# EAGLE design ModularLight (EAGLE 6.1)
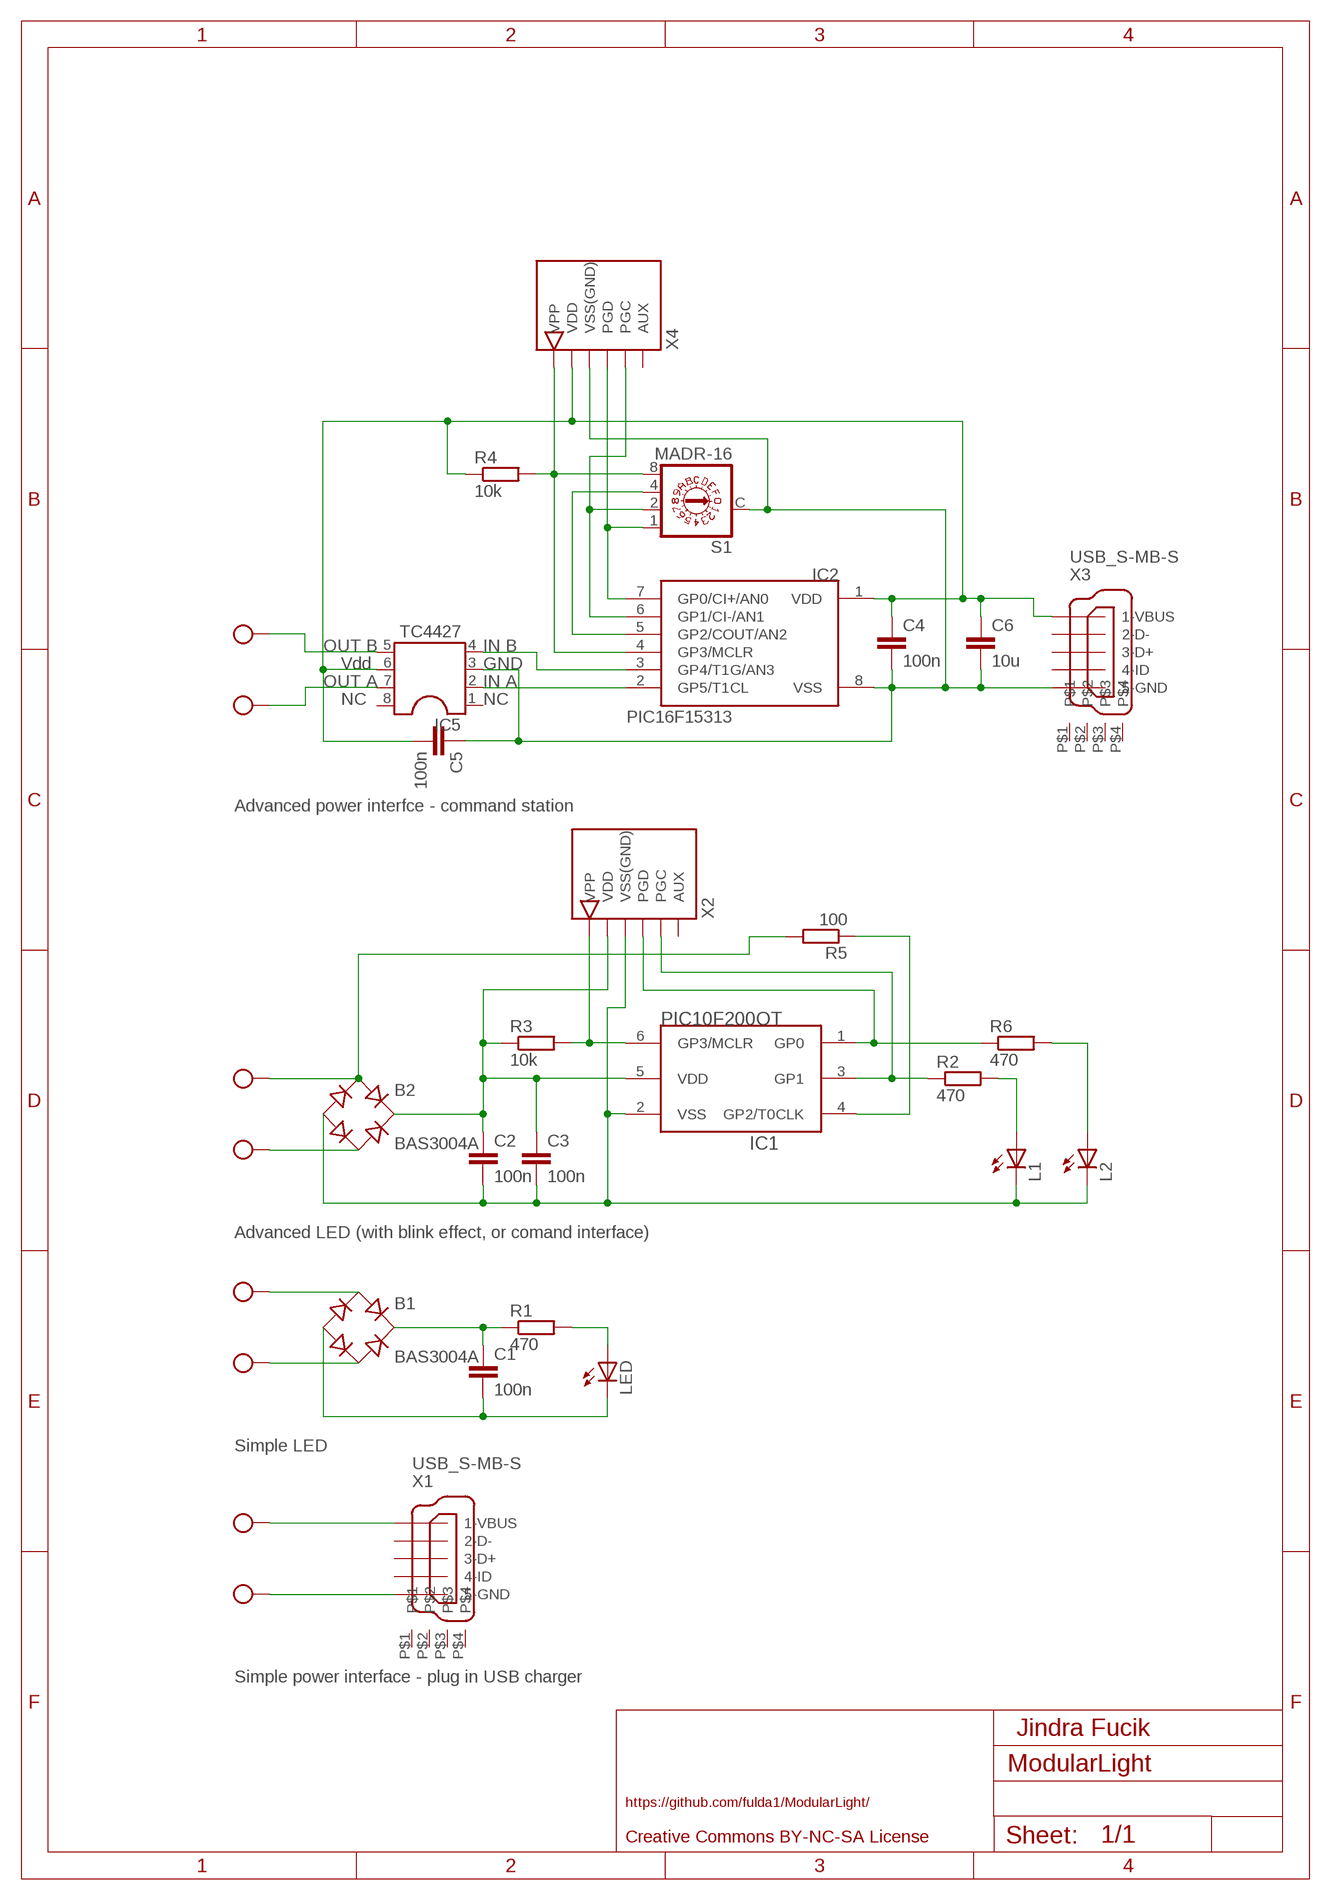
[diagram p0: schematic, sheet 1]

## Parts
B1  BAS3004A  RECTIFIER-SOT143  [SOT143]
B2  BAS3004A  RECTIFIER-SOT143  [SOT143]
C1  100n  C-EUC0805  [C0805]
C2  100n  C-EUC0805  [C0805]
C3  100n  C-EUC0805  [C0805]
C4  100n  C-EUC0805  [C0805]
C5  100n  C-EUC0805  [C0805]
C6  10u  C-EUC0805  [C0805]
IC1  PIC10F200OT  [SOT23-6]
IC2  PIC16F15313  PIC12F629SN  [SO-08]
IC5  TC4427  SO-08  [SO-08]
J1  PINHEAD_B  [2PIN_L]
J2  PINHEAD_B  [2PIN_L]
J3  PINHEAD_B  [2PIN_L]
J4  PINHEAD_B  [2PIN_L]
L1  LED3MM_I  [LED3MM_I]
L2  LED3MM_I  [LED3MM_I]
LED  LED3MM_I  [LED3MM_I]
R1  470  R-EU_R0805  [R0805]
R2  470  R-EU_R0805  [R0805]
R3  10k  R-EU_R0805  [R0805]
R4  10k  R-EU_R0805  [R0805]
R5  100  R-EU_R0805  [R0805]
R6  470  R-EU_R0805  [R0805]
S1  MADR-16  P103  [P103]
X1  USB_S-MB-S  [USB-MB-S]
X2  PICKITXS  [6PIN3]
X3  USB_S-MB-S  [USB-MB-S]
X4  PICKITXS  [6PIN3]

## Nets
N$1: J1.1 X1.VBUS(1-VBUS)
N$2: J1.2 X1.GND(5-GND)
N$3: B1.2(AC1) J2.1
N$4: B1.3(AC2) J2.2
N$5: B1.1(-) C1.2 LED.K(C)
N$6: B1.4(+) C1.1 R1.1
N$7: LED.A R1.2
N$8: B2.2(AC1) J3.1 R5.2
N$9: B2.3(AC2) J3.2
N$10: B2.1(-) C2.2 C3.2 IC1.2(VSS) L1.K(C) L2.K(C) X2.P$3(VSS(GND))
N$11: IC5.7 J4.2
N$12: L1.A R2.2
N$13: IC1.4(GP2/T0CLK) R5.1
N$14: IC1.6(GP3/MCLR) R3.2 X2.P$1(VPP)
N$15: B2.4(+) C2.1 C3.1 IC1.5(VDD) R3.1 X2.P$2(VDD)
N$16: IC1.3(GP1) R2.1 X2.P$5(PGC)
N$17: IC1.1(GP0) R6.1 X2.P$4(PGD)
N$18: IC5.5 J4.1
N$19: C4.2 C5.1 C6.2 IC2.8(VSS) IC5.3 S1.C X3.GND(5-GND) X4.P$3(VSS(GND))
N$20: C4.1 C5.2 C6.1 IC2.1(VDD) IC5.6 R4.1 X3.VBUS(1-VBUS) X4.P$2(VDD)
N$21: L2.A R6.2
N$22: IC2.2(GP5/T1CL) IC5.2
N$23: IC2.3(GP4/T1G/AN3) IC5.4
N$24: IC2.7(GP0/CI+/AN0) S1.1 X4.P$4(PGD)
N$25: IC2.6(GP1/CI-/AN1) S1.2 X4.P$5(PGC)
N$26: IC2.5(GP2/COUT/AN2) S1.4
N$27: IC2.4(GP3/MCLR) R4.2 S1.8 X4.P$1(VPP)
Unconnected: IC5.1 IC5.8 X1.D+(3-D+) X1.D-(2-D-) X1.ID(4-ID) X1.P$1 X1.P$2 X1.P$3 X1.P$4 X2.P$6(AUX) X3.D+(3-D+) X3.D-(2-D-) X3.ID(4-ID) X3.P$1 X3.P$2 X3.P$3 X3.P$4 X4.P$6(AUX)

## Notes on the sheet
- OUT B | IN B
- Vdd | GND
- OUT A | IN A
- NC | NC
- Advanced power interfce - command station
- Advanced LED (with blink effect, or comand interface)
- Simple LED
- Simple power interface - plug in USB charger
- Jindra Fucik
- https://github.com/fulda1/ModularLight/
- Creative Commons BY-NC-SA License

## Library data of the parts
B1 B2 = rectifier:RECTIFIER-: Rectifier
C1-C6 = rcl:C-EU: CAPACITOR, European symbol
IC1 = microchip-5:PIC10F20*: uPC nW 0,25/0,5k Program Flash memory
IC2 = microchip-5:PIC12F6*: uPC nW 1k Program Flash memory 2x Timer Comparator 10b A/D converter/ 4xIN
IC5 = ic-package:SO-08: Small Outline / Socket
J1-J4 = jfu_drivers:PINHEAD_B
L1 L2 LED = led:LED: LED OSRAM: - CHIPLED LG R971, LG N971, LY N971, LG Q971, LY Q971, LO R971, LY R971 LH N974, LH R974 LS Q976, LO Q976, LY Q976 LO Q996 - Hyper CHIPLED LW Q18S LB Q993, LB Q99A, LB R99A - SideLED LS A670, LO A670, LY A670, LG A670, LP A670 LB A673, LV A673, LT A673, LW A673 LH A674 LY A675 LS A676, LA A676, LO A676, LY A676, LW A676 LS A679, LY A679, LG A679 - Hyper Micro SIDELED® LS Y876, LA Y876, LO Y876, LY Y876 LT Y87S - SmartLED LW L88C, LW L88S LB L89C, LB L89S, LG L890 LS L89K, LO L89K, LY L89K LS L896, LA L896, LO L896, LY L896 - TOPLED LS T670, LO T670, LY T670, LG T670, LP T670 LSG T670, LSP T670, LSY T670, LOP T670, LYG T670 LG T671, LOG T671, LSG T671 LB T673, LV T673, LT T673, LW T673 LH T674 LS T676, LA T676, LO T676, LY T676, LB T676, LH T676, LSB T676, LW T676 LB T67C, LV T67C, LT T67C, LS T67K, LO T67K, LY T67K, LW E67C LS E67B, LA E67B, LO E67B, LY E67B, LB E67C, LV E67C, LT E67C LW T67C LS T679, LY T679, LG T679 LS T770, LO T770, LY T770, LG T770, LP T770 LB T773, LV T773, LT T773, LW T773 LH T774 LS E675, LA E675, LY E675, LS T675 LS T776, LA T776, LO T776, LY T776, LB T776 LHGB T686 LT T68C, LB T68C - Hyper Mini TOPLED® LB M676 - Mini TOPLED Santana® LG M470 LS M47K, LO M47K, LY M47K Source: http://www.osram.convergy.de LUXEON: - LUMILED® LXK2-PW12-R00, LXK2-PW12-S00, LXK2-PW14-U00, LXK2-PW14-V00 LXK2-PM12-R00, LXK2-PM12-S00, LXK2-PM14-U00 LXK2-PE12-Q00, LXK2-PE12-R00, LXK2-PE12-S00, LXK2-PE14-T00, LXK2-PE14-U00 LXK2-PB12-K00, LXK2-PB12-L00, LXK2-PB12-M00, LXK2-PB14-N00, LXK2-PB14-P00, LXK2-PB14-Q00 LXK2-PR12-L00, LXK2-PR12-M00, LXK2-PR14-Q00, LXK2-PR14-R00 LXK2-PD12-Q00, LXK2-PD12-R00, LXK2-PD12-S00 LXK2-PH12-R00, LXK2-PH12-S00 LXK2-PL12-P00, LXK2-PL12-Q00, LXK2-PL12-R00 Source: www.luxeon.com KINGBRIGHT: KA-3528ASYC Source: www.kingbright.com
R1-R6 = rcl:R-EU_: RESISTOR, European symbol
S1 = switch-dil:P103: DIL/CODE SWITCH; OC_FARNELL: unknown; OC_NEWARK: unknown
X1 X3 = con-usb-3:USB_S: USB Connectors with shield
X2 X4 = jfu_drivers:PICKIT

## Board
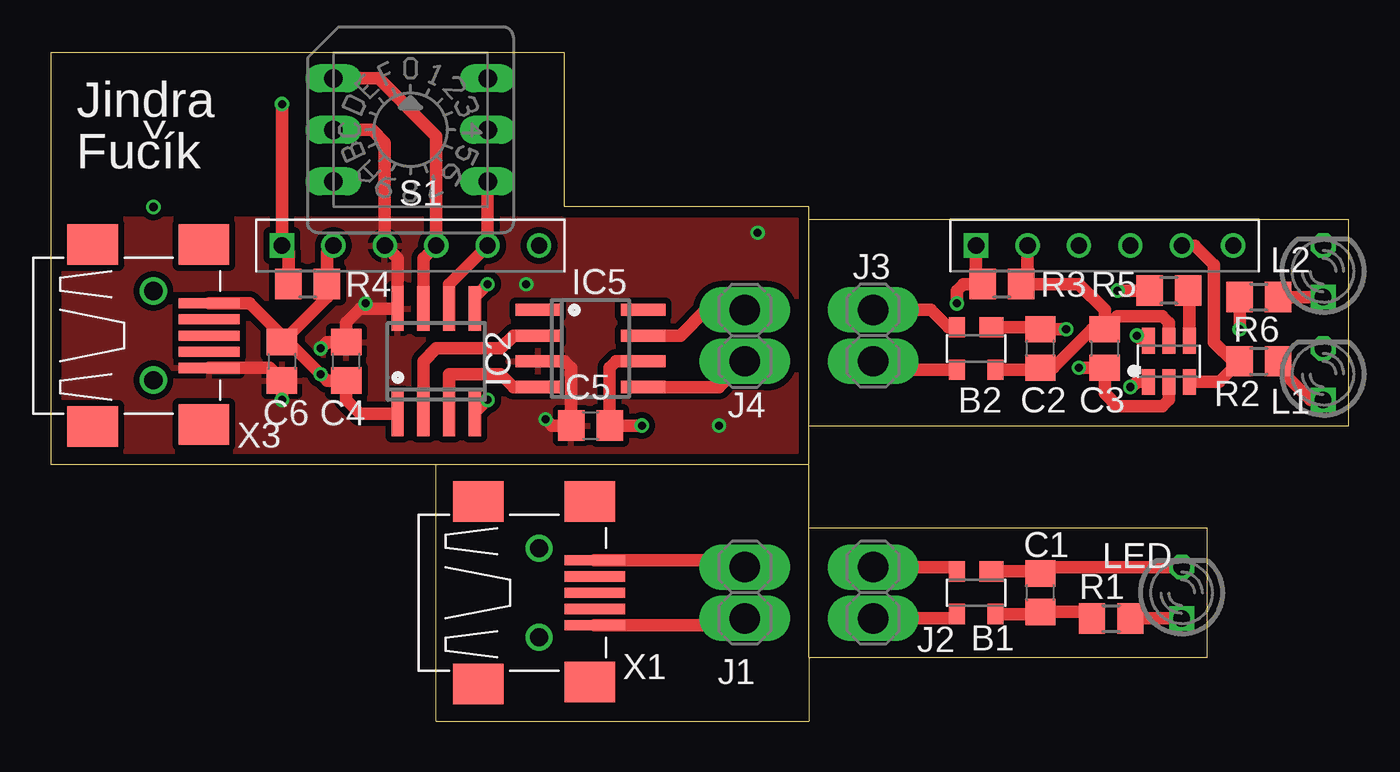
[diagram p1: board, top side]
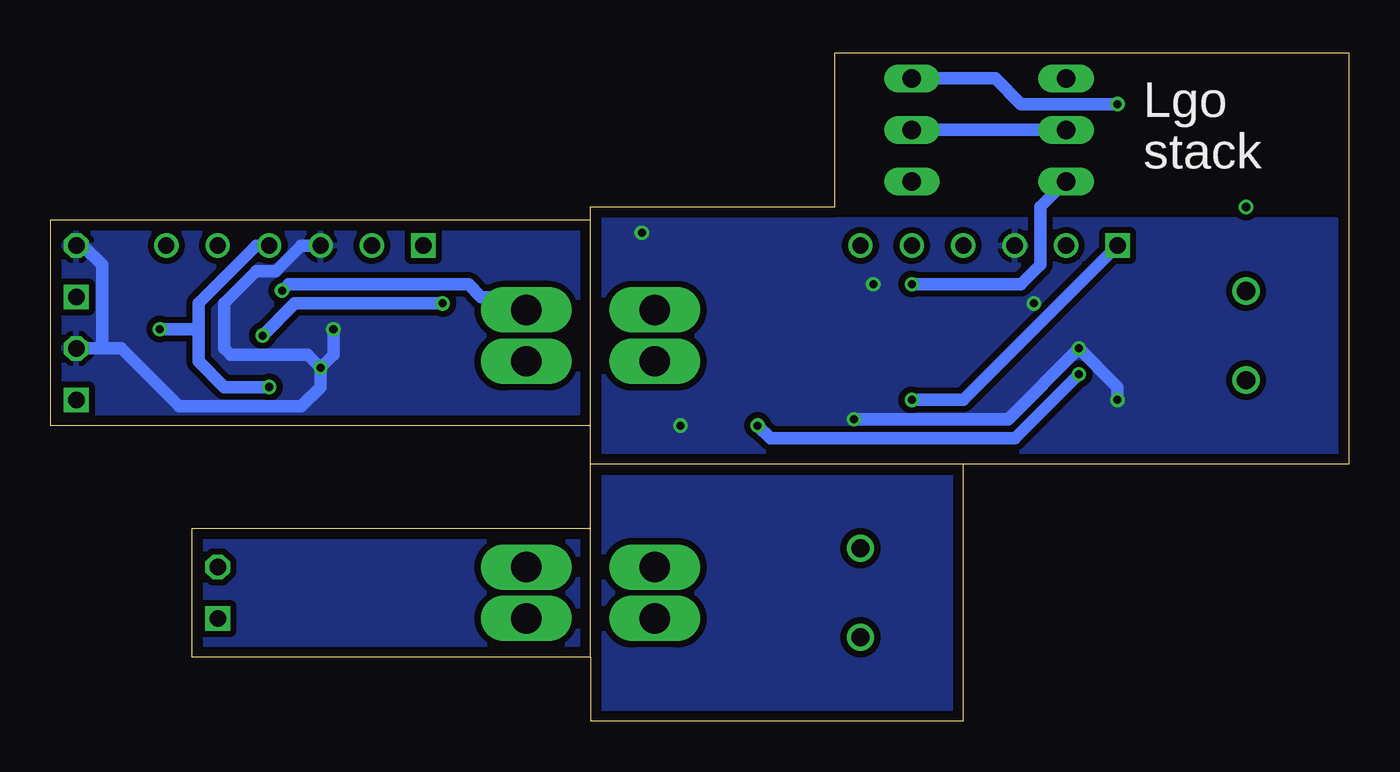
[diagram p2: board, bottom side, seen from below]

Size 64.14 x 33.02 mm. Coordinates in mm from the lower left corner, seen from the top.
Outline: 19.05,12.7 0,12.7 0,33.02 25.4,33.02 25.4,25.4 37.47,25.4 37.47,24.77
Outline: 37.47,3.17 57.15,3.17 57.15,9.53 37.47,9.53
Outline: 37.47,9.53 37.47,12.7
Outline: 37.47,12.7 37.47,14.61
Outline: 37.47,3.17 37.47,0 19.05,0 19.05,12.7
Outline: 37.47,14.61 64.14,14.61 64.14,24.77 37.47,24.77
Outline: 19.05,12.7 37.47,12.7
Outline: 37.47,14.61 37.47,24.77
Outline: 37.47,3.17 37.47,9.53
Copper layers (1*16): Top 0.035mm / dielectric 1.6mm / Bottom 0.035mm
Design rules: minimum track width 6mil, minimum drill 12mil, track to track 6mil, track to pad 6mil, pad to pad 6mil, via to via 8mil, smd to smd 0mil, copper to edge 20mil, drill to drill 10mil, minimum pad ring 6mil, minimum via ring 6mil, stop-mask expansion 0mil, vias tented up to drill 100mil, thermal gap 10mil

### Footprints (pad centres in the part's own frame; a part is rotated, then mirrored left to right if it is on the bottom)
SOT143 = smd 1.2 x 1: 1 -0.75,-1.05 | smd 0.8 x 1: 2 0.95,-1.05; 3 0.95,1.05; 4 -0.95,1.05
C0805 = smd 1.3 x 1.5: 1 -0.95,0; 2 0.95,0
SOT23-6 = smd 0.635 x 1.27: 1 -1.016,-1.016; 2 0,-1.016; 3 1.016,-1.016; 4 1.016,1.016; 5 0,1.016; 6 -1.016,1.016
SO-08 = smd 0.6 x 2.2: 1 -1.905,-2.6; 2 -0.635,-2.6; 3 0.635,-2.6; 4 1.905,-2.6; 5 1.905,2.6; 6 0.635,2.6; 7 -0.635,2.6; 8 -1.905,2.6
2PIN_L = drill 1.5 long: 1 -1.27,0; 2 1.27,0
LED3MM_I = drill 0.813 square: A -1.27,0 | drill 0.813 octagon: K 1.27,0
R0805 = smd 1.3 x 1.5: 1 -0.95,0; 2 0.95,0
P103 = drill 0.914 long: 1 3.81,-2.54; 2 -3.81,2.54; 4 3.81,2.54; 8 -3.81,-2.54; C 3.81,0; C1 -3.81,0
USB-MB-S = smd 3 x 0.5: D+ 2.75,0; D- 2.75,0.8; GND 2.75,-1.6; ID 2.75,-0.8; VBUS 2.75,1.6 | smd 2.5 x 2: P$1 -3,-4.5; P$2 -3,4.5; P$3 2.5,-4.4; P$4 2.5,4.5 | drill 0.9 pad 1.016: P$5 0,2.2; P$6 0,-2.2
6PIN3 = drill 0.8 square: P$1 0,6.35 | drill 0.8: P$2 0,3.81; P$3 0,1.27; P$4 0,-1.27; P$5 0,-3.81; P$6 0,-6.35

### Placement (x,y rotation side)
B1  45.72,6.35 180 top
B2  45.72,18.41 180 top
C1  48.9,6.35 90 top
C2  48.9,18.41 90 top
C3  52.07,18.41 270 top
C4  14.61,17.78 90 top
C5  26.67,14.61 0 top
C6  11.43,17.78 270 top
IC1  55.24,17.78 0 top
IC2  19.05,17.78 0 top
IC5  26.67,18.41 270 top
J1  34.29,6.35 270 top
J2  40.64,6.35 270 top
J3  40.64,19.05 270 top
J4  34.29,19.05 90 top
L1  62.87,17.14 90 top
L2  62.87,22.23 90 top
LED  55.88,6.35 90 top
R1  52.39,5.08 0 top
R2  59.69,17.78 0 top
R3  46.99,21.59 180 top
R4  12.7,21.59 180 top
R5  55.24,21.27 180 top
R6  59.69,20.95 0 top
S1  17.78,29.21 180 top
X1  24.13,6.35 0 top
X2  52.07,23.5 90 top
X3  5.08,19.05 0 top
X4  17.78,23.5 90 top

### Tracks (layer width: path | path; a pad name or v marks a point on that pad's centre or on a via)
N$1
  Top 0.61: X1.VBUS 33.96,7.95 J1.1
N$2
  Top 0.61: X1.GND 33.96,4.75 J1.2
N$3
  Top 0.61: J2.1 44.55,7.62 B1.2
N$4
  Top 0.61: J2.2 44.55,5.08 B1.3
N$5
  Top 0.61: B1.1 48.8,7.4 C1.2 49.22,7.62 LED.K
N$6
  Top 0.61: B1.4 48.8,5.3 C1.1 51.12,5.4 R1.1
N$7
  Top 0.61: LED.A R1.2
N$8  (via drill 0.4)
  Top 0.61: B2.2 44.35,19.46 43.5,20.32 J3.1 | R5.2 v52.7,21.27
  Bottom 0.61: v52.7,21.27 52.39,21.59 43.5,21.59 42.86,20.95 41.27,20.95 J3.1
N$9
  Top 0.61: B2.3 41.05,17.36 J3.2
N$10  (via drill 0.4)
  Top 0.61: B2.1 48.8,19.46 C2.2 v50.16,19.36 v50.16,19.37 | IC1.2 55.24,15.88 54.93,15.56 52.7,15.56 52.07,16.19 C3.2 v50.8,17.46
  Bottom 0.61: v50.16,19.37 50.16,18.1 v50.8,17.46 | L1.K 61.59,18.41 | 61.59,18.41 60.64,18.41 57.78,15.56 51.75,15.56 50.8,16.51 v50.8,17.46 | X2.P$3 51.75,23.5 53.02,22.23 53.98,22.23 55.56,20.64 55.56,18.41 55.24,18.1 51.44,18.1 v50.8,17.46 | L2.K 62.55,23.5 61.59,22.54 61.59,18.41
  pour Bottom (isolate 0.305): 38.1,15.24 63.5,15.24 63.5,24.13 38.1,24.13
N$11
  Top 0.61: IC5.7 31.11,19.05 32.38,20.32 J4.2
N$12
  Top 0.61: R2.2 60.64,17.46 62.23,15.88 L1.A
N$13
  Top 0.61: IC1.4 56.26,21.21 R5.1
N$14  (via drill 0.4)
  Top 0.61: IC1.6 53.91,18.8 v53.66,19.05 | v44.77,20.64 44.77,21.27 45.09,21.59 R3.2 45.72,21.91 X2.P$1
  Bottom 0.61: v44.77,20.64 52.07,20.64 v53.66,19.05
N$15
  Top 0.61: B2.4 48.8,17.36 C2.1 49.53,17.46 51.43,19.36 C3.1 | X2.P$2 48.26,21.91 R3.1 50.8,21.59 52.07,20.32 C3.1 | IC1.5 55.24,19.68 54.93,20 52.71,20 C3.1
N$16
  Top 0.61: IC1.3 57.72,16.76 R2.1 58.42,17.78 57.47,18.73 57.47,22.54 56.52,23.5 X2.P$5
N$17  (via drill 0.4)
  Top 0.61: IC1.1 53.72,16.76 v53.34,16.51 | v58.74,19.37 R6.1
  Bottom 0.61: X2.P$4 53.98,23.5 56.83,20.64 56.83,19.37 | 56.83,19.37 56.83,17.78 55.56,16.51 v53.34,16.51 | v58.74,19.37 56.83,19.37
N$18
  Top 0.61: IC5.5 33.02,16.51 J4.1
N$19  (via drill 0.4)
  Top 0.61: X3.GND 10.81,17.45 C6.2 v11.43,15.88 | IC5.3 25.4,17.78 25.72,17.46 C5.1 24.77,14.61 v24.45,14.92 | v13.34,18.41 13.65,18.73 C4.2 14.61,19.68 15.3,20.38 IC2.8 17.14,22.86 X4.P$3 16.51,28.57 15.88,29.21 S1.C
  Bottom 0.61: v11.43,15.88 11.43,16.51 v13.34,18.41 16.83,14.92 v24.45,14.92 | S1.C 20.95,29.21
  other vias: 33.02,14.61 34.92,24.13 23.5,21.59 15.56,20.64
  pour Bottom (isolate 0.305): 0.64,13.34 36.83,13.34 36.83,24.77 0.64,24.77
  pour Top (isolate 0.305): 0.64,13.34 36.83,13.34 36.83,24.77 0.64,24.77
N$20  (via drill 0.4)
  Top 0.61: X3.VBUS 9.83,20.65 11.43,19.05 C6.1 | C6.1 11.75,18.73 v13.34,17.14 13.65,16.83 C4.1 14.61,15.88 15.3,15.18 IC2.1 | IC5.6 27.94,17.78 27.62,17.46 C5.2 v29.21,14.61 | X4.P$2 13.65,23.18 R4.1 13.65,20.95 C6.1
  Bottom 0.61: v29.21,14.61 28.57,13.97 16.51,13.97 v13.34,17.14
N$21
  Top 0.61: R6.2 L2.A
N$22
  Top 0.61: IC5.2 22.86,19.05 22.23,18.41 19.05,18.41 18.41,17.78 IC2.2
N$23
  Top 0.61: IC5.4 22.86,16.51 22.23,17.14 19.68,17.14 IC2.3
N$24
  Top 0.61: IC2.7 18.41,22.86 X4.P$4 19.05,28.89 16.19,31.75 S1.1
N$25
  Top 0.61: IC2.6 19.68,21.59 X4.P$5 S1.2
N$26  (via drill 0.4)
  Top 0.61: IC2.5 20.95,20.95 v21.59,21.59
  Bottom 0.61: v21.59,21.59 16.19,21.59 15.24,22.54 15.24,25.4 S1.4
N$27  (via drill 0.4)
  Top 0.61: IC2.4 20.95,15.24 v21.59,15.88 | R4.2 11.75,23.18 X4.P$1 v11.43,30.48
  Bottom 0.61: v21.59,15.88 19.05,15.88 X4.P$1 | S1.8 17.46,31.75 16.19,30.48 v11.43,30.48
N$28  (via drill 0.4)
  other vias: 5.08,25.4
N$33
  pour Bottom (isolate 0.305): 19.37,0.32 36.83,0.32 36.83,12.06 19.37,12.06
N$34
  pour Bottom (isolate 0.305): 38.1,3.81 56.52,3.81 56.52,8.89 38.1,8.89

### Text on the board
tPlace: Jindra | ^ | Fucík
bPlace: Lgo | stack